# EAGLE design mega_shield_despair (EAGLE 7.6.0)
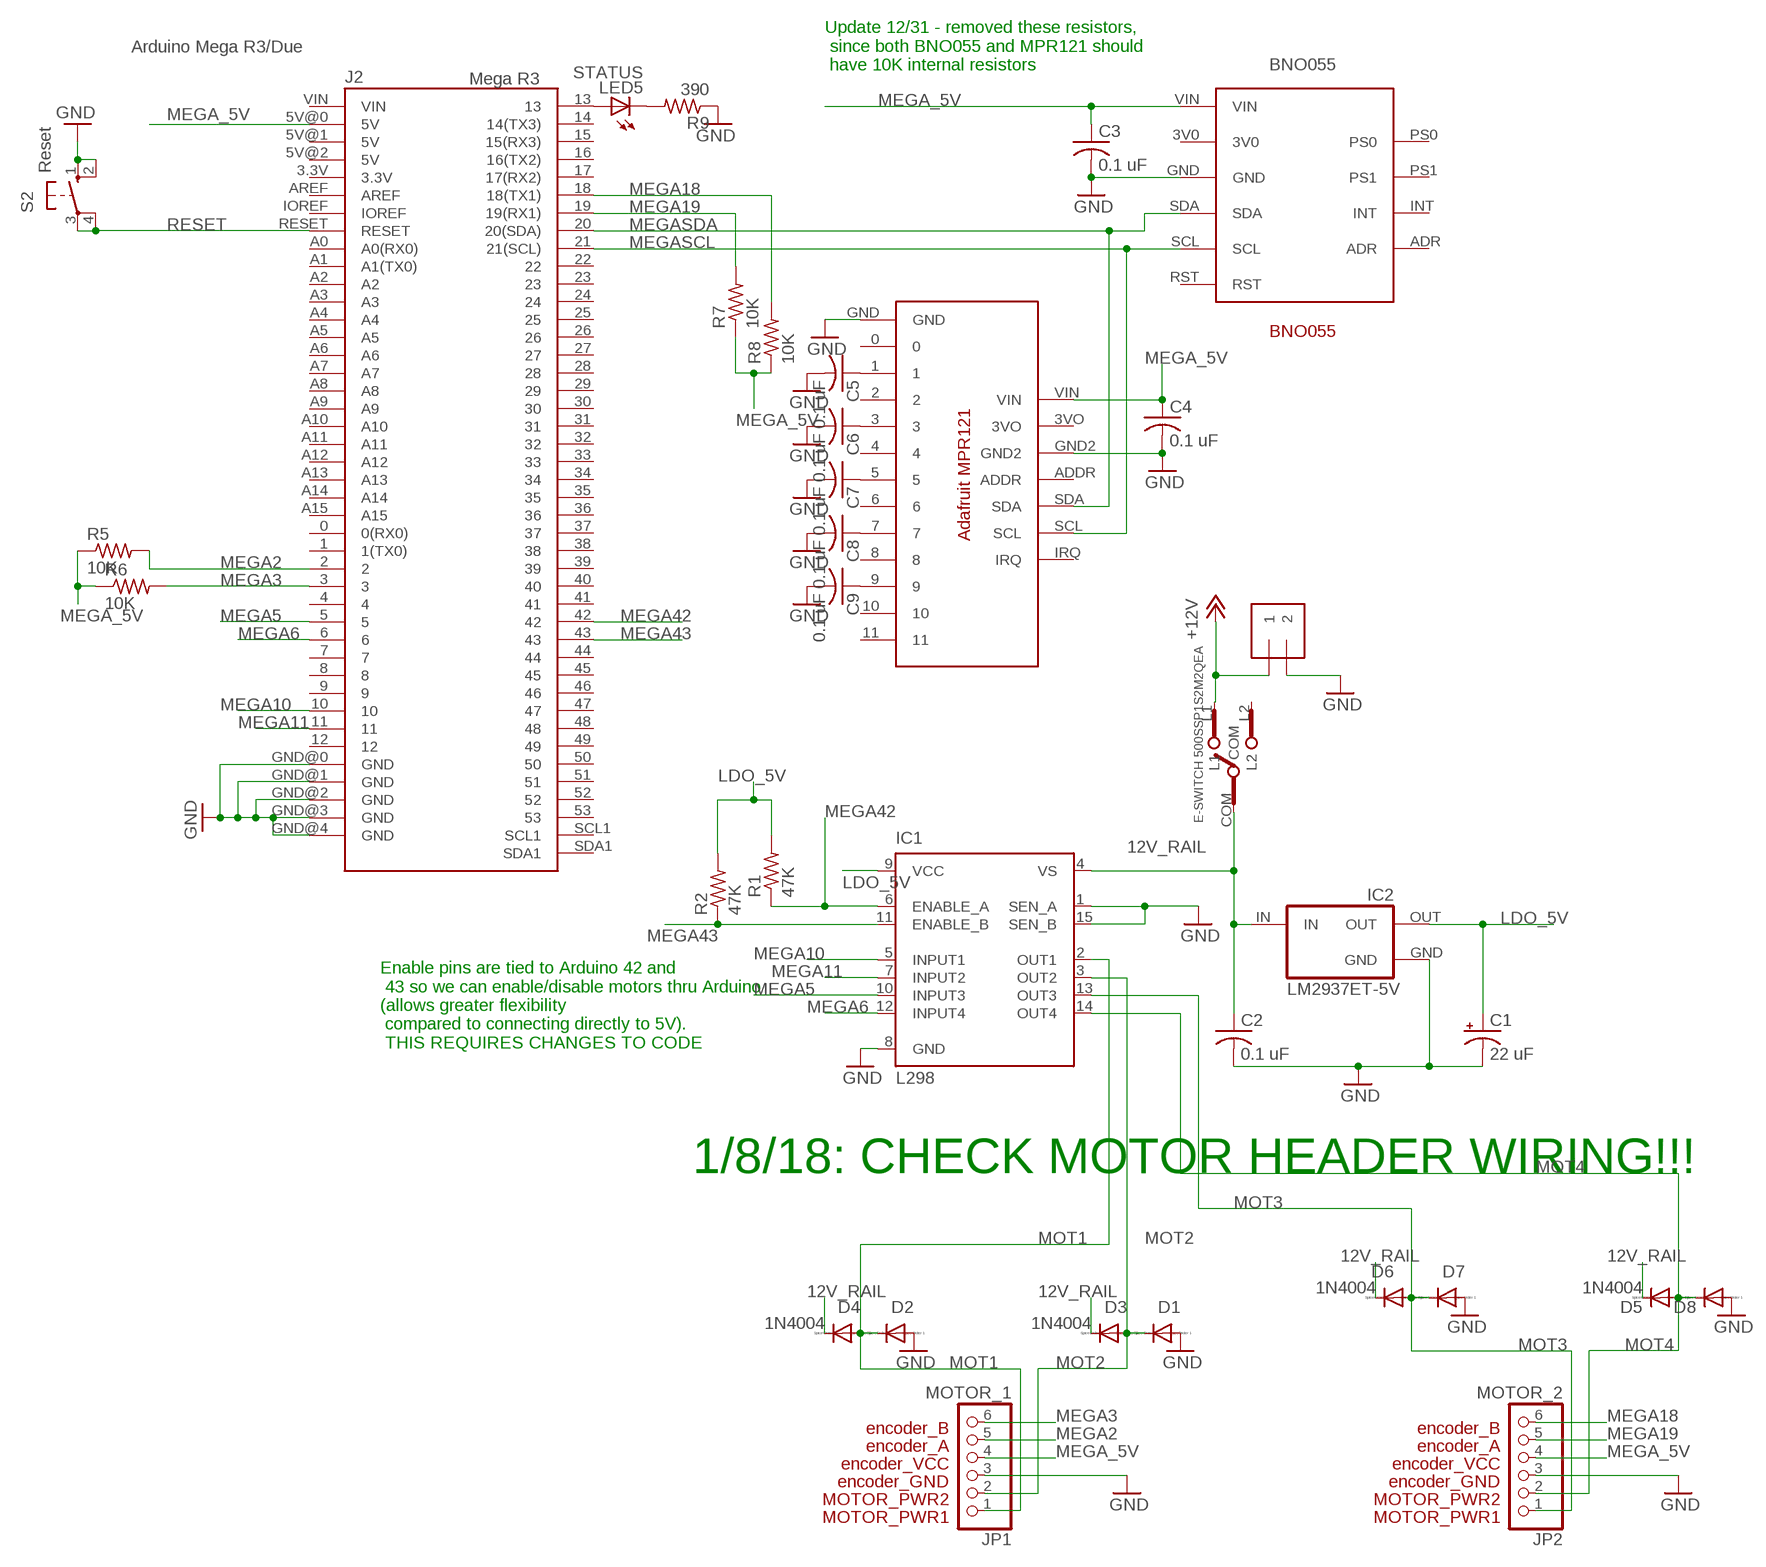
[diagram p0: schematic, sheet 1]

## Parts
12V_IN  1X2-3.5MM  [1X2-3.5MM]
BNO055  BNO055  [BNO055]
C1  22 uF  CPOL-USB45181A  [B45181A]
C2  0.1 uF  C-US025-050X050  [C025-050X050]
C3  0.1 uF  C-US025-050X050  [C025-050X050]
C4  0.1 uF  C-US025-050X050  [C025-050X050]
C5  0.1 uF  C-US025-050X050  [C025-050X050]
C6  0.1 uF  C-US025-050X050  [C025-050X050]
C7  0.1 uF  C-US025-050X050  [C025-050X050]
C8  0.1 uF  C-US025-050X050  [C025-050X050]
C9  0.1 uF  C-US025-050X050  [C025-050X050]
D1  1N4004  [DO41-10]
D2  1N4004  [DO41-10]
D3  1N4004  [DO41-10]
D4  1N4004  [DO41-10]
D5  1N4004  [DO41-10]
D6  1N4004  [DO41-10]
D7  1N4004  [DO41-10]
D8  1N4004  [DO41-10]
IC1  L298  [MULTIWATT-15]
IC2  LM2937ET-5V  LM2937ET-5,0  [TO220(V)]
J2  Mega R3  ARDUINO-MEGAFULL  [ARDUINO_MEGA]
JP1  MOTOR_1  PINHD-1X6  [1X06]
JP2  MOTOR_2  PINHD-1X6  [1X06]
LED5  STATUS  LED3MM  [LED3MM]
MPR121  ADA_MPR121  [ADA_MPR121]
R1  47K  R-US_0207/10  [0207/10]
R2  47K  R-US_0207/10  [0207/10]
R5  10K  R-US_0207/10  [0207/10]
R6  10K  R-US_0207/10  [0207/10]
R7  10K  R-US_0207/10  [0207/10]
R8  10K  R-US_0207/10  [0207/10]
R9  390  R-US_0207/10  [0207/10]
S2  Reset  10-XX  [B3F-10XX]
SLIDE_SW  E-SWITCH_500SSP1S2M2QEA  [E-SWITCH_500SSP1S2M2QEA]

## Nets
12V_RAIL [12V_PWR]: C2.1 D3.C D4.C D5.C D6.C IC1.4(VS) IC2.IN SLIDE_SW.COM
+12V [12V_PWR]: 12V_IN.1 SLIDE_SW.L1
GND: 12V_IN.2 BNO055.GND C1.- C2.2 C3.2 C4.2 C5.2 C6.2 C7.2 C8.2 C9.2 D1.A D2.A D7.A D8.A IC1.1(SEN_A) IC1.8(GND) IC1.15(SEN_B) IC2.GND J2.GND@0(GND) J2.GND@1(GND) J2.GND@2(GND) J2.GND@3(GND) J2.GND@4(GND) JP1.3 JP2.3 MPR121.GND MPR121.GND2 R9.1 S2.1(S) S2.2(S1)
LDO_5V [5V_LDO]: C1.+ IC1.9(VCC) IC2.OUT R1.2 R2.2
MEGA2: J2.2 JP1.5 R5.2
MEGA3: J2.3 JP1.6 R6.2
MEGA5: IC1.10(INPUT3) J2.5
MEGA6: IC1.12(INPUT4) J2.6
MEGA10: IC1.5(INPUT1) J2.10
MEGA11: IC1.7(INPUT2) J2.11
MEGA18: J2.18(18(TX1)) JP2.6 R8.2
MEGA19: J2.19(19(RX1)) JP2.5 R7.2
MEGA42: IC1.6(ENABLE_A) J2.42 R1.1
MEGA43: IC1.11(ENABLE_B) J2.43 R2.1
MEGA_5V [5V_LDO]: BNO055.VIN C3.1 C4.1 J2.5V@0(5V) JP1.4 JP2.4 MPR121.VIN R5.1 R6.1 R7.1 R8.1
MEGASCL: BNO055.SCL J2.21(21(SCL)) MPR121.SCL
MEGASDA: BNO055.SDA J2.20(20(SDA)) MPR121.SDA
MOT1 [12V_PWR]: D2.C D4.A IC1.2(OUT1) JP1.1
MOT2 [12V_PWR]: D1.C D3.A IC1.3(OUT2) JP1.2
MOT3 [12V_PWR]: D6.A D7.C IC1.13(OUT3) JP2.1
MOT4 [12V_PWR]: D5.A D8.C IC1.14(OUT4) JP2.2
N$1: C5.1 MPR121.1
N$2: C6.1 MPR121.3
N$3: J2.13 LED5.A
N$4: LED5.K(C) R9.2
N$5: C7.1 MPR121.5
N$6: C8.1 MPR121.7
N$8: C9.1 MPR121.9
RESET: J2.RESET S2.3(P) S2.4(P1)
Unconnected: BNO055.3V0 BNO055.ADR BNO055.INT BNO055.PS0 BNO055.PS1 BNO055.RST J2.0(0(RX0)) J2.1(1(TX0)) J2.3.3V J2.4 J2.5V@1(5V) J2.5V@2(5V) J2.7 J2.8 J2.9 J2.12 J2.14(14(TX3)) J2.15(15(RX3)) J2.16(16(TX2)) J2.17(17(RX2)) J2.22 J2.23 J2.24 J2.25 J2.26 J2.27 J2.28 J2.29 J2.30 J2.31 J2.32 J2.33 J2.34 J2.35 J2.36 J2.37 J2.38 J2.39 J2.40 J2.41 J2.44 J2.45 J2.46 J2.47 J2.48 J2.49 J2.50 J2.51 J2.52 J2.53 J2.A0(A0(RX0)) J2.A1(A1(TX0)) J2.A2 J2.A3 J2.A4 J2.A5 J2.A6 J2.A7 J2.A8 J2.A9 J2.A10 J2.A11 J2.A12 J2.A13 J2.A14 J2.A15 J2.AREF J2.IOREF J2.SCL1 J2.SDA1 J2.VIN MPR121.0 MPR121.2 MPR121.3VO MPR121.4 MPR121.6 MPR121.8 MPR121.10 MPR121.11 MPR121.ADDR MPR121.IRQ SLIDE_SW.L2

## Notes on the sheet
- Arduino Mega R3/Due
- Update 12/31 - removed these resistors,
   since both BNO055 and MPR121 should
   have 10K internal resistors
- Enable pins are tied to Arduino 42 and
   43 so we can enable/disable motors thru Arduino 
  (allows greater flexibility
   compared to connecting directly to 5V).
   THIS REQUIRES CHANGES TO CODE
- 1/8/18: CHECK MOTOR HEADER WIRING!!!

## Library data of the parts
12V_IN = adafruit:1X2: 3.5mm Terminal block http://www.ladyada.net/library/pcb/eaglelibrary.html
BNO055 = arduinoShield:BNO055
C1 = rcl:CPOL-US: POLARIZED CAPACITOR, American symbol
C2-C9 = rcl:C-US: CAPACITOR, American symbol
D1-D8 = diode:1N4004: DIODE general purpose rectifier, 1 A
IC1 = st-microelectronics:L298: DUAL FULL-BRIDGE DRIVER; MPN: L298N; OC_FARNELL: 1589425; OC_NEWARK: 32M1527
IC2 = lm2937:LM2937ET*: 400 and 500 mA Low Dropout Voltage Regulator NATIONAL SEMICONDUCTOR created by Peter.Hofmann@ph-tronic.de <mailto:Reter.Hofmann@ph-tronic.de> 10-2004 Rev.0
J2 = zortness:ARDUINO-MEGA: Arduino MegaR3 board footprint. Also works for Due.
JP1 JP2 = adafruit:PINHD-1X6: PIN HEADER
LED5 = adafruit:LED: LED OSRAM: - CHIPLED LG R971, LG N971, LY N971, LG Q971, LY Q971, LO R971, LY R971 LH N974, LH R974 LS Q976, LO Q976, LY Q976 LO Q996 - Hyper CHIPLED LW Q18S LB Q993, LB Q99A, LB R99A - SideLED LS A670, LO A670, LY A670, LG A670, LP A670 LB A673, LV A673, LT A673, LW A673 LH A674 LY A675 LS A676, LA A676, LO A676, LY A676, LW A676 LS A679, LY A679, LG A679 - Hyper Micro SIDELED® LS Y876, LA Y876, LO Y876, LY Y876 LT Y87S - SmartLED LW L88C, LW L88S LB L89C, LB L89S, LG L890 LS L89K, LO L89K, LY L89K LS L896, LA L896, LO L896, LY L896 - TOPLED LS T670, LO T670, LY T670, LG T670, LP T670 LSG T670, LSP T670, LSY T670, LOP T670, LYG T670 LG T671, LOG T671, LSG T671 LB T673, LV T673, LT T673, LW T673 LH T674 LS T676, LA T676, LO T676, LY T676, LB T676, LH T676, LSB T676, LW T676 LB T67C, LV T67C, LT T67C, LS T67K, LO T67K, LY T67K, LW E67C LS E67B, LA E67B, LO E67B, LY E67B, LB E67C, LV E67C, LT E67C LW T67C LS T679, LY T679, LG T679 LS T770, LO T770, LY T770, LG T770, LP T770 LB T773, LV T773, LT T773, LW T773 LH T774 LS E675, LA E675, LY E675, LS T675 LS T776, LA T776, LO T776, LY T776, LB T776 LHGB T686 LT T68C, LB T68C - Hyper Mini TOPLED® LB M676 - Mini TOPLED Santana® LG M470 LS M47K, LO M47K, LY M47K Source: http://www.osram.convergy.de/
MPR121 = arduinoShield:ADA_MPR121
R1 R2 R5-R9 = rcl:R-US_: RESISTOR, American symbol
S2 = switch-omron:10-XX: OMRON SWITCH; MPN: B3F-1000; OC_FARNELL: 176432; OC_NEWARK: 36M3542
SLIDE_SW = arduinoShield:E-SWITCH_500SSP1S2M2QEA

## Net classes
1 12V_PWR: width 2.159 mm
2 5V_LDO: width 0.305 mm

## Board
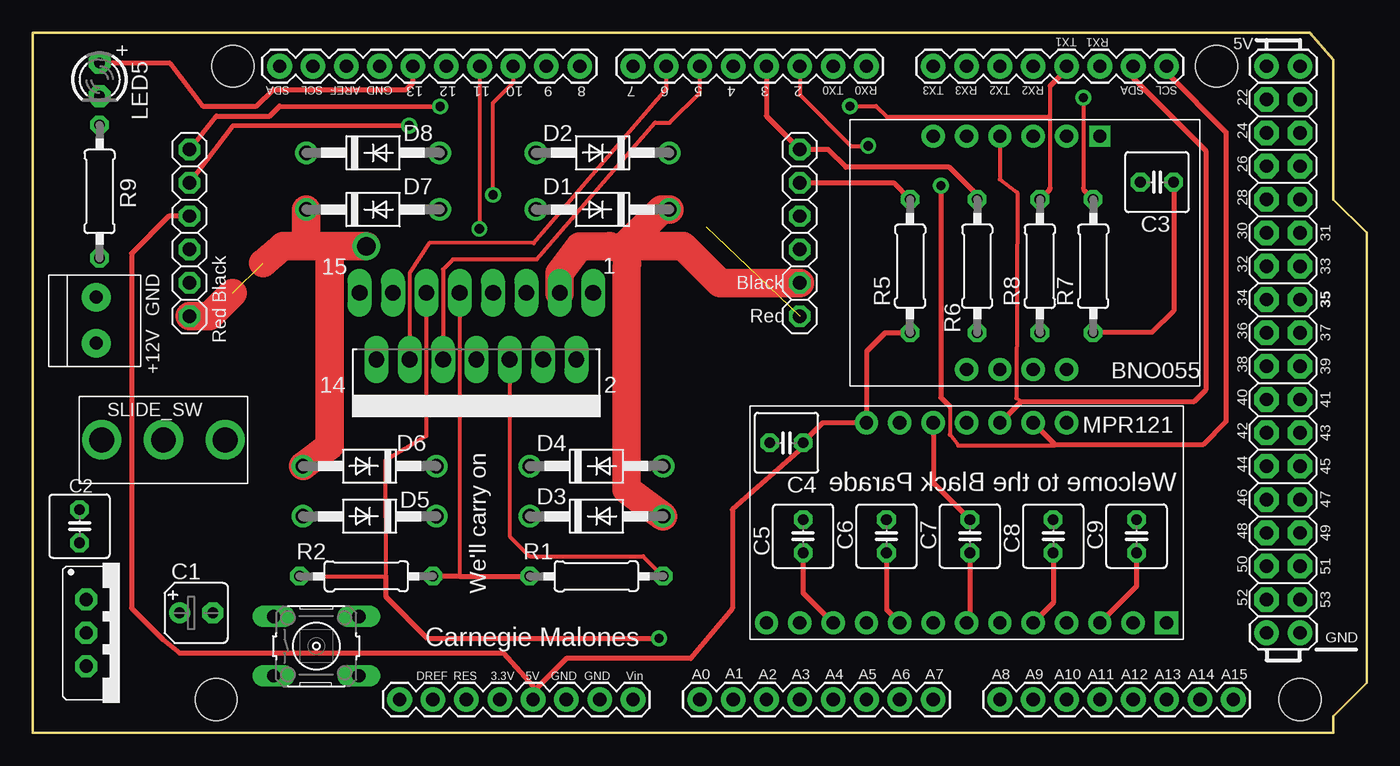
[diagram p1: board, top side]
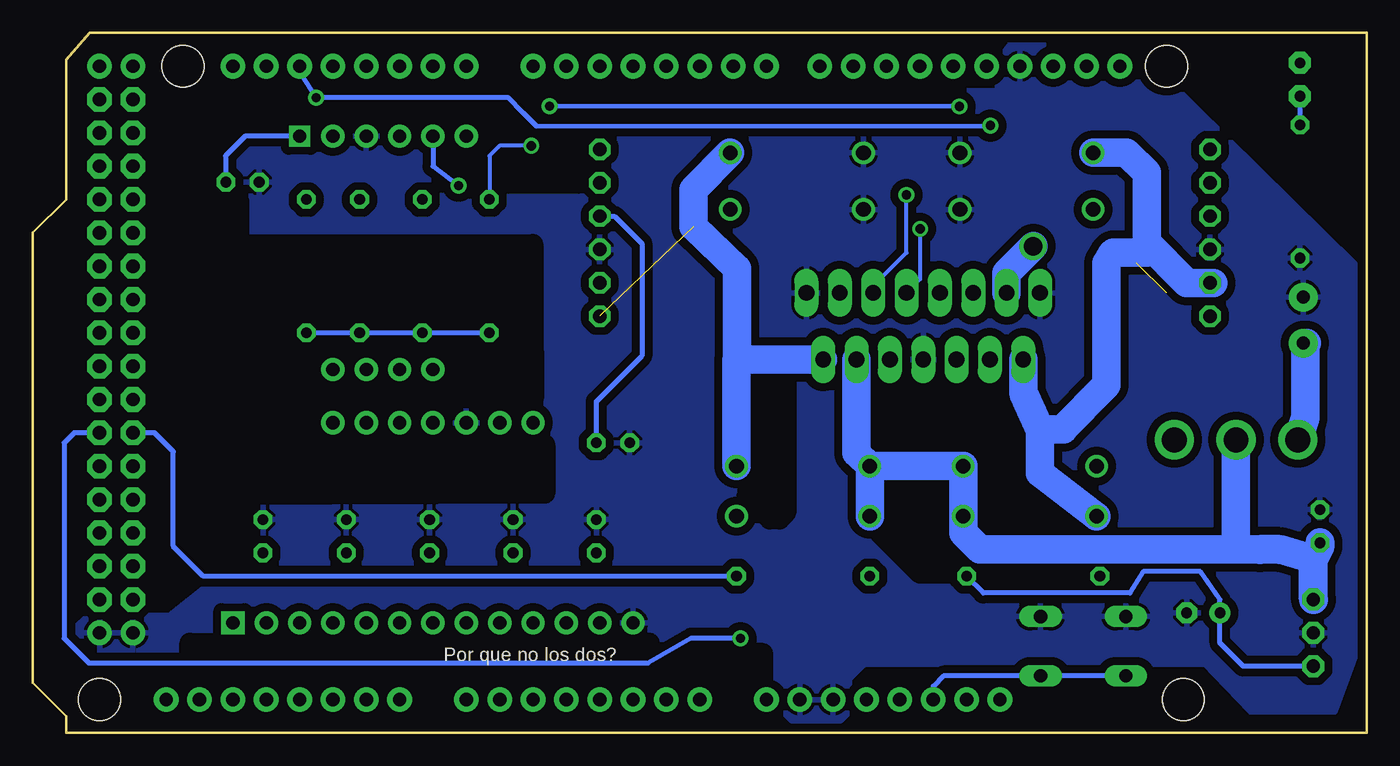
[diagram p2: board, bottom side, seen from below]

Size 101.6 x 53.34 mm. Coordinates in mm from the lower left corner, seen from the top.
Copper layers (1*16): Top 0.035mm / dielectric 1.5mm / Bottom 0.035mm
Design rules "SparkFun": minimum track width 8mil, minimum drill 20mil, track to track 8mil, track to pad 8mil, pad to pad 8mil, via to via 8mil, smd to smd 8mil, copper to edge 10mil, drill to drill 8mil, minimum pad ring 12mil, minimum via ring 10mil, stop-mask expansion 4mil, vias tented up to drill 25mil, thermal gap 10mil
bRestrict: area 44.2,16.3 to 47.2,26.9; area 26.2,15.7 to 37.3,26.2; area 30.7,12.2 to 37.1,18.8; area 88.1,33.5 to 92.5,48.9; area 63.4,25.5 to 78.2,29.5; area 85.9,38.2 to 87.3,40.5; area 62.6,18.1 to 87,21.9; area 85.5,12.9 to 88.2,17.2; area 54.6,6.2 to 89.6,6.8; area 65.7,47.1 to 79,47.4; area 63.5,29.6 to 87.6,37.2; area 46,4.3 to 52,6; area 59.9,41.9 to 65.9,45.3

### Footprints (pad centres in the part's own frame; a part is rotated, then mirrored left to right if it is on the bottom)
1X2-3.5MM = drill 1 pad 2.184: 1 1.8,0; 2 -1.7,0
BNO055 = drill 1.016 pad 1.778: 3V0 1.27,-10.16; ADR 19.05,-17.78; GND 1.27,-12.7; INT 19.05,-15.24; PS0 19.05,-10.16; PS1 19.05,-12.7; RST 1.27,-20.32; SCL 1.27,-17.78; SDA 1.27,-15.24 | drill 1.016 square: VIN 1.27,-7.62
B45181A = drill 0.813 pad 1.6: + -1.27,0 | drill 0.813 pad 1.6 octagon: - 1.27,0
C025-050X050 = drill 0.813 octagon: 1 -1.27,0; 2 1.27,0
DO41-10 = drill 1.118: A 5.08,0; C -5.08,0
MULTIWATT-15 = drill 1.2 long: 1 -8.89,-7.62; 2 -7.62,-2.54; 3 -6.35,-7.62; 4 -5.08,-2.54; 5 -3.81,-7.62; 6 -2.54,-2.54; 7 -1.27,-7.62; 8 0,-2.54; 9 1.27,-7.62; 10 2.54,-2.54; 11 3.81,-7.62; 12 5.08,-2.54; 13 6.35,-7.62; 14 7.62,-2.54; 15 8.89,-7.62
TO220(V) = drill 1.016 pad 1.676 octagon: GND 0,0; IN -2.54,0; OUT 2.54,0
ARDUINO_MEGA = drill 1.016 pad 1.88: 0 63.5,50.8; 1 60.96,50.8; 2 58.42,50.8; 3 55.88,50.8; 3.3V 35.56,2.54; 4 53.34,50.8; 5 50.8,50.8; 5V@0 38.1,2.54; 5V@1 93.98,50.8; 5V@2 96.52,50.8; 6 48.26,50.8; 7 45.72,50.8; 8 41.656,50.8; 9 39.116,50.8; 10 36.576,50.8; 11 34.036,50.8; 12 31.496,50.8; 13 28.956,50.8; 14 68.58,50.8; 15 71.12,50.8; 16 73.66,50.8; 17 76.2,50.8; 18 78.74,50.8; 19 81.28,50.8; 20 83.82,50.8; 21 86.36,50.8; A0 50.8,2.54; A1 53.34,2.54; A2 55.88,2.54; A3 58.42,2.54; A4 60.96,2.54; A5 63.5,2.54; A6 66.04,2.54; A7 68.58,2.54; A8 73.66,2.54; A9 76.2,2.54; A10 78.74,2.54; A11 81.28,2.54; A12 83.82,2.54; A13 86.36,2.54; A14 88.9,2.54; A15 91.44,2.54; AREF 23.876,50.8; EMPTY 27.94,2.54; GND@0 40.64,2.54; GND@1 43.18,2.54; GND@2 93.98,7.62; GND@3 96.52,7.62; GND@4 26.416,50.8; IOREF 30.48,2.54; RESET 33.02,2.54; SCL1 21.336,50.8; SDA1 18.796,50.8; VIN 45.72,2.54 | drill 1.016 pad 1.88 octagon: 22 93.98,48.26; 23 96.52,48.26; 24 93.98,45.72; 25 96.52,45.72; 26 93.98,43.18; 27 96.52,43.18; 28 93.98,40.64; 29 96.52,40.64; 30 93.98,38.1; 31 96.52,38.1; 32 93.98,35.56; 33 96.52,35.56; 34 93.98,33.02; 35 96.52,33.02; 36 93.98,30.48; 37 96.52,30.48; 38 93.98,27.94; 39 96.52,27.94; 40 93.98,25.4; 41 96.52,25.4; 42 93.98,22.86; 43 96.52,22.86; 44 93.98,20.32; 45 96.52,20.32; 46 93.98,17.78; 47 96.52,17.78; 48 93.98,15.24; 49 96.52,15.24; 50 93.98,12.7; 51 96.52,12.7; 52 93.98,10.16; 53 96.52,10.16 | hole 3.2: 15.24,50.8; 13.97,2.54; 90.17,50.8; 96.52,2.54
1X06 = drill 1.016 octagon: 1 -6.35,0; 2 -3.81,0; 3 -1.27,0; 4 1.27,0; 5 3.81,0; 6 6.35,0
LED3MM = drill 0.813 pad 1.676 octagon: A -1.27,0; K 1.27,0
ADA_MPR121 = drill 1.016 pad 1.778: 0 0,-2.54; 1 0,-5.08; 2 0,-7.62; 3 0,-10.16; 3VO 15.24,-10.16; 4 0,-12.7; 5 0,-15.24; 6 0,-17.78; 7 0,-20.32; 8 0,-22.86; 9 0,-25.4; 10 0,-27.94; ADDR 15.24,-15.24; GND 0,0; GND2 15.24,-12.7; IRQ 15.24,-22.86; SCL 15.24,-20.32; SDA 15.24,-17.78; VIN 15.24,-7.62 | drill 1.016 pad 1.778 square: 11 0,-30.48
0207/10 = drill 0.813 octagon: 1 -5.08,0; 2 5.08,0
B3F-10XX = drill 1.016 long: 1 -3.251,2.261; 2 3.251,2.261; 3 -3.251,-2.261; 4 3.251,-2.261
E-SWITCH_500SSP1S2M2QEA = drill 1.9 pad 3: COM 0.76,-2.61; L1 0.76,2.09; L2 0.76,-7.31

### Placement (x,y rotation side)
12V_IN  4.83,31.5 270 top
BNO055  88.9,46.74 270 top
C1  12.45,9.14 0 top
C2  3.56,15.75 90 top
C3  85.62,41.96 180 top
C4  57.4,22.1 180 top
C5  58.67,14.99 90 top
C6  65.02,14.99 90 top
C7  71.37,14.99 90 top
C8  77.72,14.99 90 top
C9  84.07,14.99 90 top
D1  43.41,39.88 180 top
D2  43.41,44.2 180 top
D3  42.93,16.51 0 top
D4  42.93,20.32 0 top
D5  25.65,16.51 180 top
D6  25.65,20.32 180 top
D7  25.91,39.88 0 top
D8  25.91,44.2 0 top
IC1  33.78,25.91 180 top
IC2  4.06,7.62 270 top
J2  0,0 0 top
JP1  58.42,38.1 90 top
JP2  11.94,38.1 90 top
LED5  5.08,49.78 270 top
MPR121  55.88,8.38 90 top
R1  42.93,11.94 180 top
R2  25.4,11.94 0 top
R5  66.83,35.56 90 top
R6  71.93,35.56 90 top
R7  80.77,35.56 90 top
R8  76.71,35.56 90 top
R9  5.08,41.25 90 top
S2  21.59,6.6 0 top
SLIDE_SW  7.34,21.56 90 top

### Tracks (layer width: path | path; a pad name or v marks a point on that pad's centre or on a via)
12V_RAIL
  Bottom 2.159: D6.C D5.C | D6.C D4.C | IC1.4 38.86,21.34 D4.C | D4.C D3.C | D6.C 30.73,15.24 29.46,13.97 10.19,13.97 | 10.19,13.97 8.13,13.97 | SLIDE_SW.COM 9.95,14.2 10.19,13.97
  Bottom 2.223: C2.1 3.56,14.22 4.06,13.21 | 4.06,13.21 6.6,13.97 8.13,13.97 | IC2.IN 4.06,13.21
+12V
  Bottom 2.159: 12V_IN.1 4.55,29.7 4.67,29.49 4.67,24.01 SLIDE_SW.L1
GND
  Top 0.381: MPR121.GND2 68.58,19.05 C7.2
  pour Bottom (isolate 0.61): 0.71,35.53 0.86,35.69 18.01,52.55 27.1,52.55 27.66,51.84 28.17,48.97 44.5,48.82 86.94,48.82 88.11,47.65 88.11,32.56 82.96,27.41 82.96,19 83.79,18.16 86.44,18.16 88.16,16.71 88.24,11.3 91.21,8.94 97.43,8.97 98.45,7.95 98.45,5.56 97.36,4.47 45.67,4.47 44.4,3.2 44.4,1.55 43.76,0.91 40.08,0.91 39.4,1.6 39.4,4.11 38.28,5.23 12.32,5.23 8.86,1.6 2.44,1.63 0.79,6.07 0.69,35.48
LDO_5V
  Top 0.305: IC1.9 32.51,11.94
  Top 0.381: R2.2 32.51,11.94 R1.2
  Bottom 0.381: R2.2 29.21,10.67 18.03,10.67 16.99,12.29 12.67,12.29 11.18,10.16 C1.+ 11.18,6.86 9.4,5.08 IC2.OUT
MEGA2  (via drill 0.7)
  Top 0.305: J2.2 58.42,48.62 62.33,44.7 63.6,44.7 v63.63,44.73
  Top 0.381: JP1.5 65.56,41.91 R5.2
  Bottom 0.305: v63.63,44.73 66.07,44.73 66.83,43.97 R5.2
MEGA3
  Top 0.381: J2.3 55.88,46.99 JP1.6 60.58,44.45 61.93,43.1 69.8,43.1 71.93,40.97 R6.2
MEGA5
  Top 0.305: IC1.10 31.24,35.31 32,36.07 38.38,36.07 47.4,46.51 48.51,46.48 50.8,48.77 J2.5
MEGA6
  Top 0.305: IC1.12 28.7,35.05 30.23,37.34 38.15,37.31 48.29,49.07 J2.6
MEGA10  (via drill 0.7)
  Top 0.305: v35.05,41 35.05,48.01 36.58,49.53 J2.10
  Bottom 0.305: IC1.5 37.59,34.04 35.05,36.58 v35.05,41
MEGA11  (via drill 0.7)
  Top 0.305: J2.11 34.04,38.43 v34.01,38.4
  Bottom 0.305: IC1.7 34.01,34.57 v34.01,38.4
MEGA18  (via drill 0.7)
  Top 0.305: 77.47,49.28 77.47,47.12 | 77.47,47.12 77.47,41.51 | v62.23,47.75 64.24,47.75 65.05,46.94 77.29,46.94 77.47,47.12
  Top 0.381: J2.18 78.74,50.65 arc-45 78.67,50.47 77.47,49.28 | 77.47,41.51 arc-45 77.4,41.33 R8.2 | JP2.6 13.97,46.99 18.03,46.99 18.8,47.75 v31.01,47.73
  Bottom 0.381: v31.01,47.73 v62.23,47.75
MEGA19  (via drill 0.7)
  Top 0.305: 80.08,41.33 arc-45 80.01,41.51 v80.01,48.39
  Top 0.381: 80.08,41.33 R7.2 | JP2.5 15.24,46.23 v28.65,46.28
  Bottom 0.381: J2.19 81.21,50.73 81.21,50.22 v80.01,48.39 65.35,48.39 64.26,47.24 63.25,46.23 v28.65,46.28
MEGA42
  Top 0.305: IC1.6 36.32,14.99 37.85,13.46 46.48,13.46 R1.1
  Bottom 0.381: R1.1 88.62,11.94 90.91,14.22 90.91,21.44 92.33,22.86 J2.42
MEGA43  (via drill 0.7)
  Top 0.305: IC1.11 29.97,22.61 26.85,20.75 26.87,11.94 R2.1
  Top 0.381: v47.7,7.21 30.05,7.21 26.87,10.39 26.87,11.94
  Bottom 0.381: J2.43 98.45,22.86 99.21,22.1 99.21,7.19 97.36,5.33 54.71,5.33 51.46,7.21 v47.7,7.21
MEGA_5V
  Top 0.381: 38.1,3.12 38.1,3.56 35.81,6.1 11.18,6.1 9.91,7.11 7.52,9.5 7.52,36.53 10.36,39.37 JP2.4 | 38.1,3.12 J2.5V@0 | C3.1 86.89,32.16 85.24,30.51 80.8,30.51 R7.1 | R5.1 64.92,30.48 63.5,29.06 MPR121.VIN 63.49,23.63 60.18,23.63 58.67,22.13 C4.1 58.67,21.74 53.29,17.02 53.29,9.5 50.11,5.66 40.64,5.66 38.1,3.12
  Bottom 0.381: JP1.4 57.29,39.37 55.21,37.29 55.21,28.72 58.67,25.26 C4.1 | BNO055.VIN 85.42,45.47 86.92,43.97 86.92,41.99 C3.1 | R7.1 R8.1 R6.1 R5.1
MEGASCL  (via drill 0.7)
  Top 0.305: 77.79,22.03 77.8,21.89 70.48,21.89 69.85,22.73 69.85,24.87
  Top 0.381: J2.21 86.36,50.29 90.88,45.77 90.88,23.72 89.1,21.95 77.88,21.95 77.79,22.03 MPR121.SCL | v69.16,41.71 69.16,25.55 69.85,24.87
  Bottom 0.381: BNO055.SCL 71.12,43.18 v69.16,41.71
MEGASDA
  Top 0.305: BNO055.SDA 73.66,42.19 74.98,41.17 74.9,25.5 75.36,25.22
  Top 0.381: J2.20 83.82,49.89 89.33,44.37 89.33,26.14 88.42,25.22 75.36,25.22 75.26,25.22 MPR121.SDA
MOT1  (1 unrouted)
  Bottom 2.159: IC1.2 47.98,28.45 | 47.98,28.45 47.98,28.4 | 47.98,28.45 47.98,35.38 51.28,38.56 51.28,41.4 D2.C | D4.A 48.01,28.42 47.98,28.45
MOT2
  Top 2.159: D3.A 45.21,18.54 45.21,35.31 45.34,36.96 | 45.34,36.96 45.13,36.76 44.84,36.84 | 44.84,36.84 43.94,37.08 41.63,37.06 40.13,35.05 IC1.3 | 45.34,36.96 45.21,37.08 49.53,37.08 52.32,34.29 JP1.2 | D1.C 47.87,39.88 44.84,36.84
MOT3  (via drill 1.4)  (1 unrouted)
  Top 2.159: v25.4,37.08 22.61,37.08 | 22.61,37.08 22.61,21.84 D6.A | 15.24,33.53 13.46,31.75 JP2.1 | 17.53,35.81 19.05,37.08 20.32,37.08 | 20.32,37.08 22.61,37.08 | D7.C 20.83,37.59 20.32,37.08
  Bottom 2.159: IC1.13 27.43,35.05 v25.4,37.08
MOT4
  Bottom 2.159: 23.11,23.11 23.19,23.11 | 23.19,23.11 24.89,23.11 | 24.89,23.11 24.89,19.81 D5.A | IC1.14 26.16,25.91 24.89,23.11 | 11.68,34.29 JP2.2 13.72,34.29 16.76,37.34 | D8.C 18.29,44.2 16.76,42.67 16.76,37.34 | 16.76,37.34 16.76,36.58 19.3,36.58 19.43,36.45 19.81,35.81 19.81,26.49 23.19,23.11
N$1
  Top 0.381: C5.1 58.67,10.67 MPR121.1
N$2
  Top 0.381: C6.1 65.02,9.4 MPR121.3
N$3
  Top 0.381: LED5.A 10.41,51.05 12.95,47.75 17.02,47.75 18.29,49.02 28.45,49.02 28.96,49.53 J2.13
N$4
  Bottom 0.381: LED5.K R9.2
N$5
  Top 0.381: C7.1 71.37,8.64 MPR121.5
N$6
  Top 0.381: C8.1 77.72,9.91 MPR121.7
N$8
  Top 0.381: C9.1 84.07,11.18 MPR121.9
RESET
  Bottom 0.381: S2.3 S2.4 32.23,4.34 33.02,3.56 J2.RESET

### Text on the board
tNames: Black | Black | GND | +12V | Red | Red | Welcome to the Black Parade | We'll carry on | Carnegie Malones
bNames: Por que no los dos?